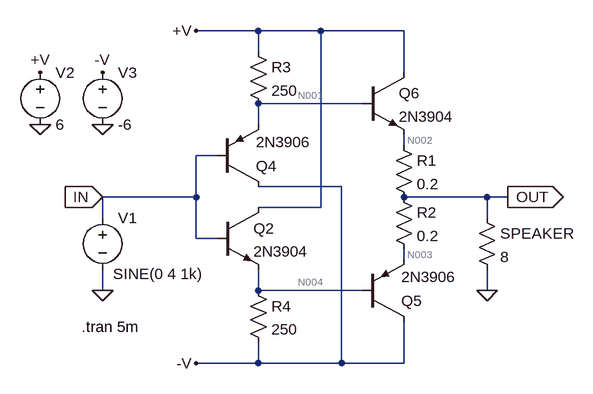
[diagram p0: schematic Circuit7_11.asc]
Circuit7_11.asc, the LTspice schematic file:
Version 4
SHEET 1 880 680
WIRE 160 80 64 80
WIRE 256 80 160 80
WIRE 384 80 256 80
WIRE 160 112 160 80
WIRE 384 144 384 80
WIRE 320 192 160 192
WIRE 160 224 160 192
WIRE 384 256 384 240
WIRE 96 272 64 272
WIRE 288 320 160 320
WIRE 64 336 64 272
WIRE 64 336 -80 336
WIRE 512 336 384 336
WIRE 544 336 512 336
WIRE 256 352 256 80
WIRE 256 352 160 352
WIRE -80 368 -80 336
WIRE 512 368 512 336
WIRE 64 400 64 336
WIRE 96 400 64 400
WIRE 384 432 384 416
WIRE -80 480 -80 448
WIRE 160 480 160 448
WIRE 320 480 160 480
WIRE 512 480 512 448
WIRE 160 592 160 560
WIRE 160 592 64 592
WIRE 288 592 288 320
WIRE 288 592 160 592
WIRE 384 592 384 528
WIRE 384 592 288 592
FLAG 64 80 +V
FLAG 64 592 -V
FLAG -176 224 0
FLAG -80 224 0
FLAG -176 144 +V
FLAG -80 144 -V
FLAG 544 336 OUT
IOPIN 544 336 Out
FLAG 512 480 0
FLAG -80 480 0
FLAG -80 336 IN
IOPIN -80 336 In
SYMBOL npn 96 352 R0
SYMATTR InstName Q2
SYMATTR Value 2N3904
SYMBOL pnp 96 320 M180
WINDOW 0 60 32 Left 2
WINDOW 3 60 69 Left 2
SYMATTR InstName Q4
SYMATTR Value 2N3906
SYMBOL res 368 240 R0
SYMATTR InstName R1
SYMATTR Value 0.2
SYMBOL res 368 320 R0
SYMATTR InstName R2
SYMATTR Value 0.2
SYMBOL res 144 96 R0
SYMATTR InstName R3
SYMATTR Value 250
SYMBOL res 144 464 R0
SYMATTR InstName R4
SYMATTR Value 250
SYMBOL voltage -176 128 R0
SYMATTR InstName V2
SYMATTR Value 6
SYMBOL voltage -80 128 R0
SYMATTR InstName V3
SYMATTR Value -6
SYMBOL pnp 320 528 M180
WINDOW 0 60 32 Left 2
WINDOW 3 60 69 Left 2
SYMATTR InstName Q5
SYMATTR Value 2N3906
SYMBOL npn 320 144 R0
SYMATTR InstName Q6
SYMATTR Value 2N3904
SYMBOL res 496 352 R0
SYMATTR InstName SPEAKER
SYMATTR Value 8
SYMBOL voltage -80 352 R0
WINDOW 3 16 102 Left 2
WINDOW 123 24 38 Left 2
WINDOW 39 0 0 Left 0
SYMATTR Value SINE(0 4 1k)
SYMATTR InstName V1
TEXT -112 536 Left 2 !.tran 5m

The netlist it stands for:
* Circuit7_11.asc
Q2 +V IN N004 0 2N3904
Q4 -V IN N001 0 2N3906
R1 N002 OUT 0.2
R2 OUT N003 0.2
R3 +V N001 250
R4 N004 -V 250
V2 +V 0 6
V3 -V 0 -6
Q5 -V N004 N003 0 2N3906
Q6 +V N001 N002 0 2N3904
R§SPEAKER OUT 0 8
V1 IN 0 SINE(0 4 1k)
.model NPN NPN
.model PNP PNP
.lib standard.bjt
.tran 5m
.backanno
.end

* Results of the author's LTspice run, read from the files saved beside the schematic
* Operating Point, zero values left out:
*   V(+v) = 6 V
*   V(n004) = -736.9 mV
*   V(-v) = -6 V
*   V(n001) = 737.6 mV
*   V(n002) = 4.259 mV
*   V(out) = 557.1 µV
*   V(n003) = -3.131 mV
*   Ic(Q5) = -18.35 mA
*   Ib(Q5) = -90.95 µA
*   Ie(Q5) = 18.44 mA
*   Ic(Q4) = -20.89 mA
*   Ib(Q4) = -103.4 µA
*   Ie(Q4) = 20.99 mA
*   Ic(Q6) = 18.45 mA
*   Ib(Q6) = 60.98 µA
*   Ie(Q6) = -18.51 mA
*   Ic(Q2) = 20.89 mA
*   Ib(Q2) = 68.94 µA
*   Ie(Q2) = -20.96 mA
*   I(Speaker) = 69.64 µA
*   I(R4) = 21.05 mA
*   I(R3) = 21.05 mA
*   I(R2) = 18.44 mA
*   I(R1) = 18.51 mA
*   I(V1) = 34.43 µA
*   I(V3) = 60.29 mA
*   I(V2) = -60.39 mA
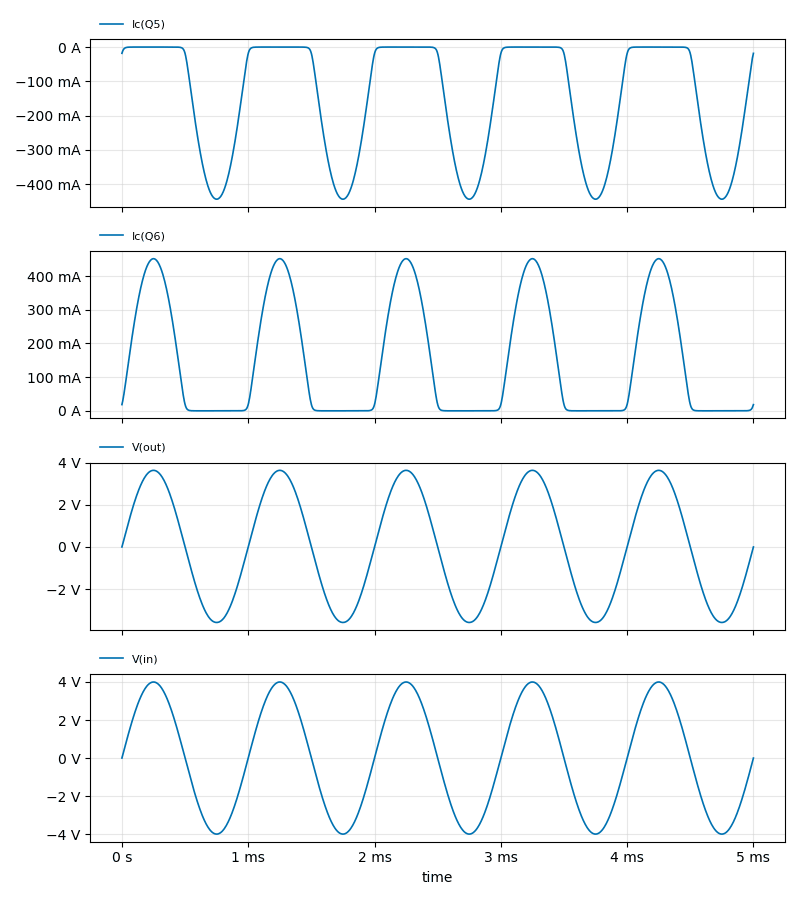
[diagram p1: Transient Analysis of Circuit7_11.asc, plotted from the saved traces]
* Transient Analysis, 1 run:
*   Ic(Q5): min -444 mA, max -51.26 nA, average -143.3 mA, rms 223.5 mA, last -18.35 mA
*   Ic(Q6): min 0 A, max 451.9 mA, average 145.1 mA, rms 226.6 mA, last 18.45 mA
*   V(out): min -3.589 V, max 3.64 V, average 11.25 mV, rms 2.565 V, last 545.2 µV
*   V(in): min -4 V, max 4 V, average 0 V, rms 2.828 V, last 0 V